# Altium schematic sheet BOOT0.SchDoc
size A
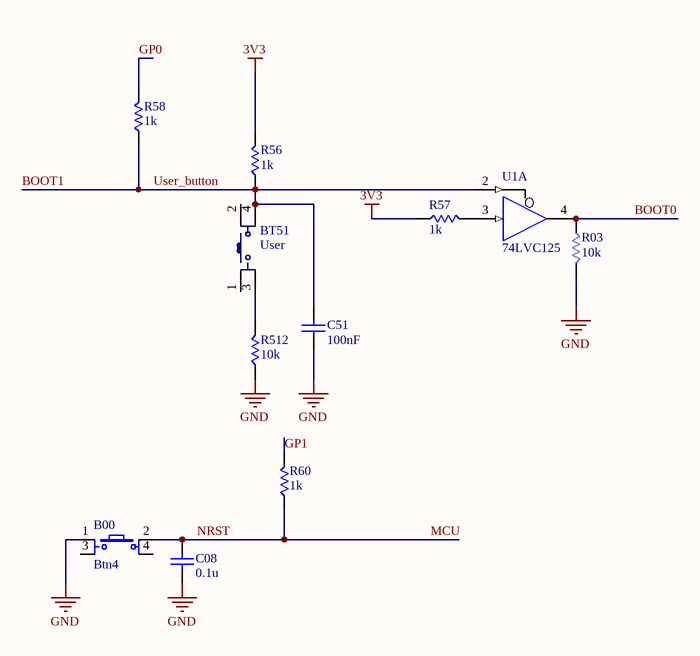
[diagram p0: BOOT0.SchDoc]

## Parts
B00  Btn4  [Btn-waterproof-smd]
BT51  User  [Btn-waterproof-smd]
C08  value 0.1u  [SM_0805_LD]  (hidden comment: CAP Ceramic)
C51  value 100nF  [SM_0805_LD]  (hidden comment: C_Ceramic)
R03  value 10k  [SM_0805_LD]  (hidden comment: R)
R56  value 1k  [SM_0805_LD]  (hidden comment: R)
R57  value 1k  [SM_0805_LD]  (hidden comment: R)
R58  value 1k  [SM_0805_LD]  (hidden comment: R)
R60  value 1k  [SM_0805_LD]  (hidden comment: R)
R512  value 10k  [SM_0805_LD]  (hidden comment: R)
U1  74LVC125  [FK020]  (part A of 4)

## Nets
3V3: R56.2 R57.1
GND: B00.1(Tab) C08.1 C51.1 R03.2 R512.1 U1.10(GND)
VCC: U1.20(VCC)
BOOT0: R03.1 U1.4(Y)
BOOT1: BT51.4 C51.2 R56.1 R58.1 U1.2(~{OE})  [also labelled User_button]
GP0: R58.2
GP1: R60.2
MCU: B00.2(Tab) C08.2 R60.1  [also labelled NRST]
NetBT51_3: BT51.3 R512.2
NetR57_2: R57.2 U1.3(A)

Not connected (* = marked no-connect by the designer): B00 3(Tab) 4(Tab); BT51 1 2

## Library data of the parts
BT51 = Button: Tact switch
C08 = CAP Ceramic: Non-polarity ceramic capacitor; Published: 8-Jun-2000; LatestRevisionDate: 17-Jul-2002; LatestRevisionNote: Re-released for DXP Platform.; PackageReference: RAD-0.3; Publisher: Altium Limited; PackageDescription: Radial Cap, Thru-Hole; 2 Leads; 0.3 in Pin Spacing
C51 = C_Ceramic: Non-polarity ceramic capacitor; Published: 8-Jun-2000; LatestRevisionDate: 17-Jul-2002; LatestRevisionNote: Re-released for DXP Platform.; PackageReference: RAD-0.3; Publisher: Altium Limited; PackageDescription: Radial Cap, Thru-Hole; 2 Leads; 0.3 in Pin Spacing
R03 R56-R58 R60 R512 = R: Resistor; Published: 8-Jun-2000; LatestRevisionDate: 29-May-2009; LatestRevisionNote: IPC-7351 Footprint Added.; PackageReference: J1-0603; Publisher: Altium Limited; PackageDescription: Chip Resistor
U1 = SN54BCT125AFK: Quadruple Bus Buffer Gate with 3-State Outputs; Note: Pins No 1,5,7,11,15 and 17 are not connected; Published: 8-Jun-2000; LatestRevisionDate: 17-Jul-2002; LatestRevisionNote: Re-released for DXP Platform.; DatasheetVersion: Apr-1994; PackageVersion: 1998; PackageReference: FK020; Publisher: Altium Limited; PackageDescription: Leadless Chip Carrier; 20 Terminals; Body 8.9 x 8.9 mm; ComponentLink1Description: Manufacturer Link; ComponentLink1URL: http://www.ti.com/; ComponentLink2Description: Datasheet; ComponentLink2URL: http://www-s.ti.com/sc/ds/sn74bct125a.pdf